# Altium schematic sheet AMEPD_Port.SchDoc
size A4; SheetNumber: 7; SheetTotal: 7
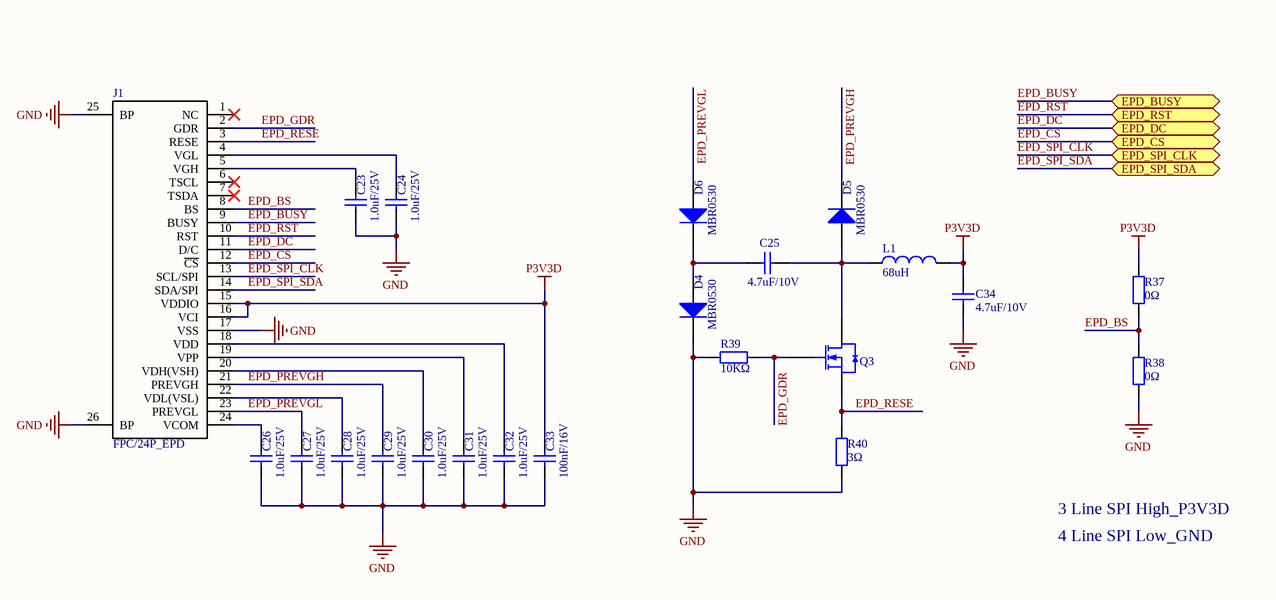
[diagram p0: AMEPD_Port.SchDoc]

## Parts
C23  1.0uF/25V  [0402_C]
C24  1.0uF/25V  [0402_C]
C25  4.7uF/10V  [0402_C]
C26  1.0uF/25V  [0402_C]
C27  1.0uF/25V  [0402_C]
C28  1.0uF/25V  [0402_C]
C29  1.0uF/25V  [0402_C]
C30  1.0uF/25V  [0402_C]
C31  1.0uF/25V  [0402_C]
C32  1.0uF/25V  [0402_C]
C33  100nF/16V  [0402_C]
C34  4.7uF/10V  [0402_C]
D4  MBR0530  [SOD-123]
D5  MBR0530  [SOD-123]
D6  MBR0530  [SOD-123]
J1  FPC/24P_EPD  [FPC/24P_EPD]
L1  68uH  [LSMD4X4]
Q3  AO3400A N道沟 X0YV1T SOT-23  [SOT-23-3L]  (value not drawn)
R37  0Ω  [0402_R]
R38  0Ω  [0402_R]
R39  10KΩ  [0402_R]
R40  3Ω  [0402_R]

## Ports
EPD_BUSY (bidir), EPD_CS (bidir), EPD_DC (bidir), EPD_RST (bidir), EPD_SPI_CLK (bidir), EPD_SPI_SDA (bidir)

## Nets
GND: C23.1 C24.1 C26.1 C27.1 C28.1 C29.1 C30.1 C31.1 C32.1 C33.2 C34.1 D4.2(K) J1.17(VSS) J1.25(BP) J1.26(BP) R38.1 R39.1 R40.1
P3V3D: C33.1 C34.2 J1.15(VDDIO) J1.16(VCI) L1.2 R37.2
EPD_BS: J1.8(BS) R37.1 R38.2
EPD_BUSY: J1.9(BUSY) ; port EPD_BUSY
EPD_CS: J1.12(~{CS}) ; port EPD_CS
EPD_DC: J1.11(D/C) ; port EPD_DC
EPD_GDR: J1.2(GDR) Q3.1(G) R39.2
EPD_PREVGH: C29.2 D5.2(K) J1.21(PREVGH)
EPD_PREVGL: C27.2 D6.1(A) J1.23(PREVGL)
EPD_RESE: J1.3(RESE) Q3.2(S) R40.2
EPD_RST: J1.10(RST) ; port EPD_RST
EPD_SPI_CLK: J1.13(SCL/SPI) ; port EPD_SPI_CLK
EPD_SPI_SDA: J1.14(SDA/SPI) ; port EPD_SPI_SDA
NetC23_2: C23.2 J1.5(VGH)
NetC24_2: C24.2 J1.4(VGL)
NetC25_1: C25.1 D4.1(A) D6.2(K)
NetC25_2: C25.2 D5.1(A) L1.1 Q3.3(D)
NetC26_2: C26.2 J1.24(VCOM)
NetC28_2: C28.2 J1.22(VDL(VSL))
NetC30_2: C30.2 J1.20(VDH(VSH))
NetC31_2: C31.2 J1.19(VPP)
NetC32_2: C32.2 J1.18(VDD)

Not connected (* = marked no-connect by the designer): J1 1(NC)* 6(TSCL)* 7(TSDA)*

## Notes on the sheet
- 3 Line SPI High_P3V3D
- 4 Line SPI Low_GND
- Date:
- Size:
- Project Title:
- A4
- Revision:
- Sheet:
- of:
- File:
- Author:
- Chenhui Zhao

## Library data of the parts
C23 C24 C26-C32 = 0402 1.0uF (105) 10% 25V: 贴片电容; ComponentLink1Description: 供应商链接; ComponentLink1URL: http://www.szlcsc.com/product/details_53938.html; Package: 0402; Supplier: LC; SuppliersPartNumber: C52923
C25 C34 = 0402 4.7uF (475) 20% 10V: 贴片电容; ComponentLink1Description: 供应商链接; ComponentLink1URL: http://www.szlcsc.com/product/details_24469.html; Package: 0402; Supplier: LC; SuppliersPartNumber: C23733
C33 = 0402 100nF (104) 10% 16V: 贴片电容; ComponentLink1Description: 供应商链接; ComponentLink1URL: http://www.szlcsc.com/product/details_1877.html; Package: 0402; Supplier: LC; SuppliersPartNumber: C1525
D4-D6 = SOD-123 B5819W  SL: 肖特基二极管; ComponentLink1Description: 供应商链接; ComponentLink1URL: http://www.szlcsc.com/product/details_9093.html; Package: SOD-123; Supplier: LC; SuppliersPartNumber: C8598
J1 = FPC/24P_EPD: Active Matrix Electrophoretic Display (AMEPD)
L1 = L: Inductor; Value: 10u
Q3 = AO3400A N道沟 X0YV1T SOT-23: MOS(场效应管); ComponentLink1Description: 供应商链接; ComponentLink1URL: http://www.szlcsc.com/product/details_21629.html; Package: SOT-23; Supplier: LC; SuppliersPartNumber: C20917
R37 R38 = 0402 0Ω (0R0) 1%: 贴片电阻; ComponentLink1Description: 供应商链接; ComponentLink1URL: http://www.szlcsc.com/product/details_17853.html; Package: 0402; Supplier: LC; SuppliersPartNumber: C17168
R39 = 0402 10KΩ (1002) 1%: 贴片电阻; ComponentLink1Description: 供应商链接; ComponentLink1URL: http://www.szlcsc.com/product/details_26487.html; Package: 0402; Supplier: LC; SuppliersPartNumber: C25744
R40 = 0402 33Ω (33R0) 1%: 贴片电阻; ComponentLink1Description: 供应商链接; ComponentLink1URL: http://www.szlcsc.com/product/details_25848.html; Package: 0402; Supplier: LC; SuppliersPartNumber: C25105